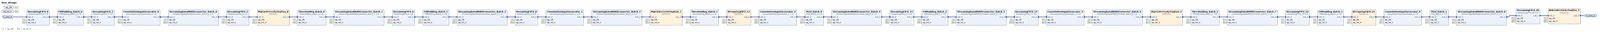
[diagram p0: block diagram of the top level, whole]
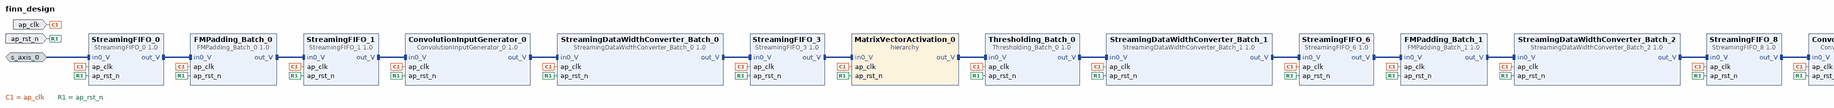
[diagram p1: block diagram of the top level, left part]
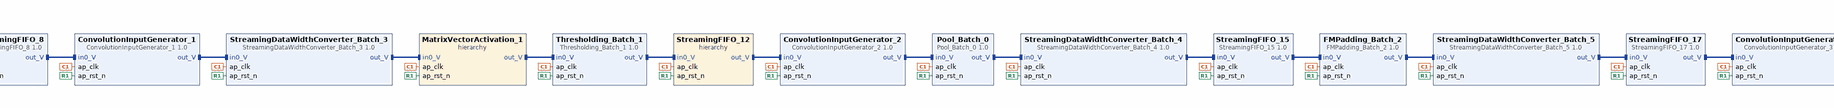
[diagram p2: block diagram of the top level, centre part]
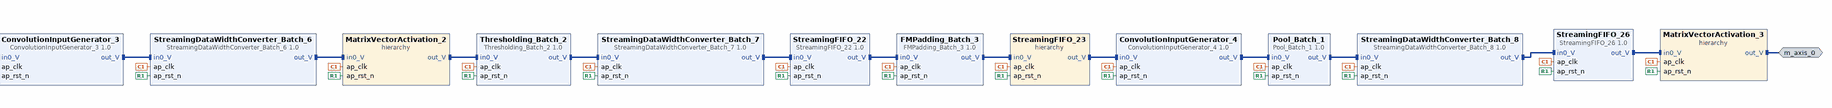
[diagram p3: block diagram of the top level, right part]
# Vivado block design finn_design, xc7z020clg400-1, Vivado 2022.1
create_bd_design finn_design

create_bd_intf_port -mode Slave -vlnv xilinx.com:interface:axis_rtl:1.0 s_axis_0
set_property -dict [list \
  CONFIG.FREQ_HZ 100000000.000000 \
  CONFIG.HAS_TKEEP 0 \
  CONFIG.HAS_TLAST 0 \
  CONFIG.HAS_TREADY 1 \
  CONFIG.HAS_TSTRB 0 \
  CONFIG.LAYERED_METADATA undef \
  CONFIG.TDATA_NUM_BYTES 1 \
  CONFIG.TDEST_WIDTH 0 \
  CONFIG.TID_WIDTH 0 \
  CONFIG.TUSER_WIDTH 0 \
] [get_bd_intf_ports s_axis_0]
create_bd_intf_port -mode Master -vlnv xilinx.com:interface:axis_rtl:1.0 m_axis_0
set_property -dict {CONFIG.FREQ_HZ 100000000.000000} [get_bd_intf_ports m_axis_0]
create_bd_port -dir I -type clk ap_clk
set_property -dict {CONFIG.FREQ_HZ 100000000.000000} [get_bd_ports ap_clk]
create_bd_port -dir I -type rst ap_rst_n

create_bd_cell -type ip -vlnv xilinx.com:hls:StreamingFIFO_0:1.0 StreamingFIFO_0
create_bd_cell -type ip -vlnv xilinx.com:hls:FMPadding_Batch_0:1.0 FMPadding_Batch_0
create_bd_cell -type ip -vlnv xilinx.com:hls:StreamingFIFO_1:1.0 StreamingFIFO_1
create_bd_cell -type ip -vlnv xilinx.com:hls:ConvolutionInputGenerator_0:1.0 ConvolutionInputGenerator_0
create_bd_cell -type ip -vlnv xilinx.com:hls:StreamingDataWidthConverter_Batch_0:1.0 StreamingDataWidthConverter_Batch_0
create_bd_cell -type ip -vlnv xilinx.com:hls:StreamingFIFO_3:1.0 StreamingFIFO_3
create_bd_cell -type hier MatrixVectorActivation_0
create_bd_cell -type ip -vlnv xilinx.com:hls:Thresholding_Batch_0:1.0 Thresholding_Batch_0
create_bd_cell -type ip -vlnv xilinx.com:hls:StreamingDataWidthConverter_Batch_1:1.0 StreamingDataWidthConverter_Batch_1
create_bd_cell -type ip -vlnv xilinx.com:hls:StreamingFIFO_6:1.0 StreamingFIFO_6
create_bd_cell -type ip -vlnv xilinx.com:hls:FMPadding_Batch_1:1.0 FMPadding_Batch_1
create_bd_cell -type ip -vlnv xilinx.com:hls:StreamingDataWidthConverter_Batch_2:1.0 StreamingDataWidthConverter_Batch_2
create_bd_cell -type ip -vlnv xilinx.com:hls:StreamingFIFO_8:1.0 StreamingFIFO_8
create_bd_cell -type ip -vlnv xilinx.com:hls:ConvolutionInputGenerator_1:1.0 ConvolutionInputGenerator_1
create_bd_cell -type ip -vlnv xilinx.com:hls:StreamingDataWidthConverter_Batch_3:1.0 StreamingDataWidthConverter_Batch_3
create_bd_cell -type hier MatrixVectorActivation_1
create_bd_cell -type ip -vlnv xilinx.com:hls:Thresholding_Batch_1:1.0 Thresholding_Batch_1
create_bd_cell -type hier StreamingFIFO_12
create_bd_cell -type ip -vlnv xilinx.com:hls:ConvolutionInputGenerator_2:1.0 ConvolutionInputGenerator_2
create_bd_cell -type ip -vlnv xilinx.com:hls:Pool_Batch_0:1.0 Pool_Batch_0
create_bd_cell -type ip -vlnv xilinx.com:hls:StreamingDataWidthConverter_Batch_4:1.0 StreamingDataWidthConverter_Batch_4
create_bd_cell -type ip -vlnv xilinx.com:hls:StreamingFIFO_15:1.0 StreamingFIFO_15
create_bd_cell -type ip -vlnv xilinx.com:hls:FMPadding_Batch_2:1.0 FMPadding_Batch_2
create_bd_cell -type ip -vlnv xilinx.com:hls:StreamingDataWidthConverter_Batch_5:1.0 StreamingDataWidthConverter_Batch_5
create_bd_cell -type ip -vlnv xilinx.com:hls:StreamingFIFO_17:1.0 StreamingFIFO_17
create_bd_cell -type ip -vlnv xilinx.com:hls:ConvolutionInputGenerator_3:1.0 ConvolutionInputGenerator_3
create_bd_cell -type ip -vlnv xilinx.com:hls:StreamingDataWidthConverter_Batch_6:1.0 StreamingDataWidthConverter_Batch_6
create_bd_cell -type hier MatrixVectorActivation_2
create_bd_cell -type ip -vlnv xilinx.com:hls:Thresholding_Batch_2:1.0 Thresholding_Batch_2
create_bd_cell -type ip -vlnv xilinx.com:hls:StreamingDataWidthConverter_Batch_7:1.0 StreamingDataWidthConverter_Batch_7
create_bd_cell -type ip -vlnv xilinx.com:hls:StreamingFIFO_22:1.0 StreamingFIFO_22
create_bd_cell -type ip -vlnv xilinx.com:hls:FMPadding_Batch_3:1.0 FMPadding_Batch_3
create_bd_cell -type hier StreamingFIFO_23
create_bd_cell -type ip -vlnv xilinx.com:hls:ConvolutionInputGenerator_4:1.0 ConvolutionInputGenerator_4
create_bd_cell -type ip -vlnv xilinx.com:hls:Pool_Batch_1:1.0 Pool_Batch_1
create_bd_cell -type ip -vlnv xilinx.com:hls:StreamingDataWidthConverter_Batch_8:1.0 StreamingDataWidthConverter_Batch_8
create_bd_cell -type ip -vlnv xilinx.com:hls:StreamingFIFO_26:1.0 StreamingFIFO_26
create_bd_cell -type hier MatrixVectorActivation_3

# ---- hierarchy /MatrixVectorActivation_0 ----
current_bd_instance /MatrixVectorActivation_0
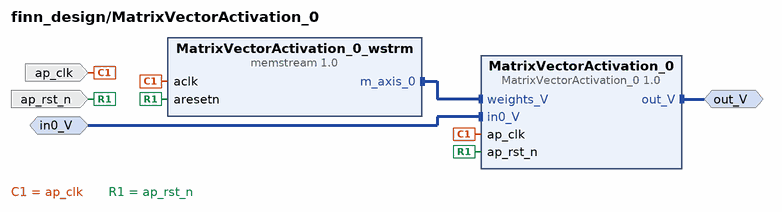
[diagram p4: block diagram inside /MatrixVectorActivation_0]
create_bd_intf_pin -mode Master -vlnv xilinx.com:interface:axis_rtl:1.0 out_V
create_bd_intf_pin -mode Slave -vlnv xilinx.com:interface:axis_rtl:1.0 in0_V
create_bd_pin -dir I -type clk ap_clk
create_bd_pin -dir I -type rst ap_rst_n

create_bd_cell -type ip -vlnv xilinx.com:hls:MatrixVectorActivation_0:1.0 MatrixVectorActivation_0
create_bd_cell -type ip -vlnv xilinx.com:user:memstream:1.0 MatrixVectorActivation_0_wstrm
set_property -dict [list \
  CONFIG.MEM_DEPTH 16 \
  CONFIG.MEM_INIT /scratch/bkwan/FINN/finn/ML_LL/Model/CNN-1D/tmp/code_gen_ipgen_MatrixVectorActivation_0_wx4gew9p/ \
  CONFIG.MEM_WIDTH 72 \
  CONFIG.NSTREAMS 1 \
  CONFIG.RAM_STYLE auto \
  CONFIG.STRM0_DEPTH 16 \
  CONFIG.STRM0_OFFSET 0 \
  CONFIG.STRM0_WIDTH 72 \
] [get_bd_cells MatrixVectorActivation_0_wstrm]

# ---- hierarchy /MatrixVectorActivation_1 ----
current_bd_instance /MatrixVectorActivation_1
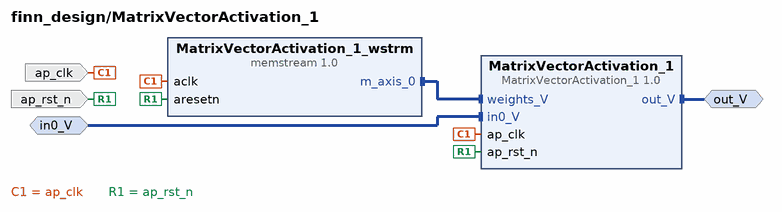
[diagram p5: block diagram inside /MatrixVectorActivation_1]
create_bd_intf_pin -mode Master -vlnv xilinx.com:interface:axis_rtl:1.0 out_V
create_bd_intf_pin -mode Slave -vlnv xilinx.com:interface:axis_rtl:1.0 in0_V
create_bd_pin -dir I -type clk ap_clk
create_bd_pin -dir I -type rst ap_rst_n

create_bd_cell -type ip -vlnv xilinx.com:hls:MatrixVectorActivation_1:1.0 MatrixVectorActivation_1
create_bd_cell -type ip -vlnv xilinx.com:user:memstream:1.0 MatrixVectorActivation_1_wstrm
set_property -dict [list \
  CONFIG.MEM_DEPTH 16 \
  CONFIG.MEM_INIT /scratch/bkwan/FINN/finn/ML_LL/Model/CNN-1D/tmp/code_gen_ipgen_MatrixVectorActivation_1__w__vqmd/ \
  CONFIG.MEM_WIDTH 2304 \
  CONFIG.NSTREAMS 1 \
  CONFIG.RAM_STYLE auto \
  CONFIG.STRM0_DEPTH 16 \
  CONFIG.STRM0_OFFSET 0 \
  CONFIG.STRM0_WIDTH 2304 \
] [get_bd_cells MatrixVectorActivation_1_wstrm]

# ---- hierarchy /StreamingFIFO_12 ----
current_bd_instance /StreamingFIFO_12
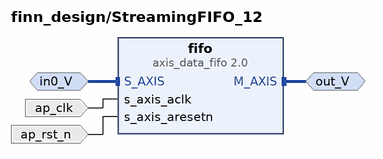
[diagram p6: block diagram inside /StreamingFIFO_12]
create_bd_intf_pin -mode Master -vlnv xilinx.com:interface:axis_rtl:1.0 out_V
create_bd_intf_pin -mode Slave -vlnv xilinx.com:interface:axis_rtl:1.0 in0_V
create_bd_pin -dir I -type clk ap_clk
create_bd_pin -dir I -type rst ap_rst_n

create_bd_cell -type ip -vlnv xilinx.com:ip:axis_data_fifo:2.0 fifo
set_property -dict {CONFIG.FIFO_DEPTH 512 CONFIG.FIFO_MEMORY_TYPE auto CONFIG.TDATA_NUM_BYTES 2} [get_bd_cells fifo]

# ---- hierarchy /MatrixVectorActivation_2 ----
current_bd_instance /MatrixVectorActivation_2
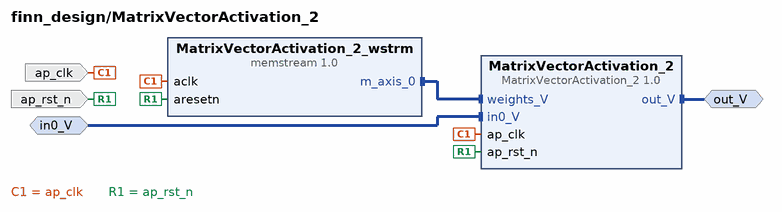
[diagram p7: block diagram inside /MatrixVectorActivation_2]
create_bd_intf_pin -mode Master -vlnv xilinx.com:interface:axis_rtl:1.0 out_V
create_bd_intf_pin -mode Slave -vlnv xilinx.com:interface:axis_rtl:1.0 in0_V
create_bd_pin -dir I -type clk ap_clk
create_bd_pin -dir I -type rst ap_rst_n

create_bd_cell -type ip -vlnv xilinx.com:hls:MatrixVectorActivation_2:1.0 MatrixVectorActivation_2
create_bd_cell -type ip -vlnv xilinx.com:user:memstream:1.0 MatrixVectorActivation_2_wstrm
set_property -dict [list \
  CONFIG.MEM_DEPTH 64 \
  CONFIG.MEM_INIT /scratch/bkwan/FINN/finn/ML_LL/Model/CNN-1D/tmp/code_gen_ipgen_MatrixVectorActivation_2_g310_uuv/ \
  CONFIG.MEM_WIDTH 2304 \
  CONFIG.NSTREAMS 1 \
  CONFIG.RAM_STYLE auto \
  CONFIG.STRM0_DEPTH 64 \
  CONFIG.STRM0_OFFSET 0 \
  CONFIG.STRM0_WIDTH 2304 \
] [get_bd_cells MatrixVectorActivation_2_wstrm]

# ---- hierarchy /StreamingFIFO_23 ----
current_bd_instance /StreamingFIFO_23
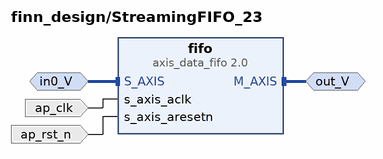
[diagram p8: block diagram inside /StreamingFIFO_23]
create_bd_intf_pin -mode Master -vlnv xilinx.com:interface:axis_rtl:1.0 out_V
create_bd_intf_pin -mode Slave -vlnv xilinx.com:interface:axis_rtl:1.0 in0_V
create_bd_pin -dir I -type clk ap_clk
create_bd_pin -dir I -type rst ap_rst_n

create_bd_cell -type ip -vlnv xilinx.com:ip:axis_data_fifo:2.0 fifo
set_property -dict {CONFIG.FIFO_DEPTH 1024 CONFIG.FIFO_MEMORY_TYPE auto CONFIG.TDATA_NUM_BYTES 2} [get_bd_cells fifo]

# ---- hierarchy /MatrixVectorActivation_3 ----
current_bd_instance /MatrixVectorActivation_3
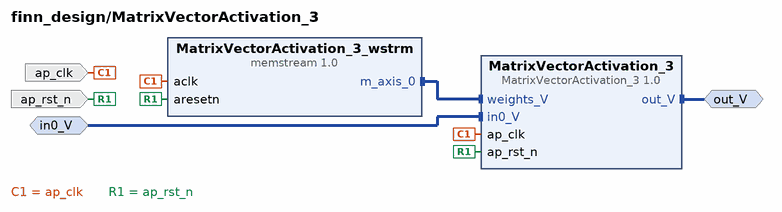
[diagram p9: block diagram inside /MatrixVectorActivation_3]
create_bd_intf_pin -mode Master -vlnv xilinx.com:interface:axis_rtl:1.0 out_V
create_bd_intf_pin -mode Slave -vlnv xilinx.com:interface:axis_rtl:1.0 in0_V
create_bd_pin -dir I -type clk ap_clk
create_bd_pin -dir I -type rst ap_rst_n

create_bd_cell -type ip -vlnv xilinx.com:hls:MatrixVectorActivation_3:1.0 MatrixVectorActivation_3
create_bd_cell -type ip -vlnv xilinx.com:user:memstream:1.0 MatrixVectorActivation_3_wstrm
set_property -dict [list \
  CONFIG.MEM_DEPTH 960 \
  CONFIG.MEM_INIT /scratch/bkwan/FINN/finn/ML_LL/Model/CNN-1D/tmp/code_gen_ipgen_MatrixVectorActivation_3_w6za0nuu/ \
  CONFIG.MEM_WIDTH 32 \
  CONFIG.NSTREAMS 1 \
  CONFIG.RAM_STYLE auto \
  CONFIG.STRM0_DEPTH 960 \
  CONFIG.STRM0_OFFSET 0 \
  CONFIG.STRM0_WIDTH 32 \
] [get_bd_cells MatrixVectorActivation_3_wstrm]

# ---- connections ----

current_bd_instance /MatrixVectorActivation_0
connect_bd_intf_net [get_bd_intf_pins out_V] [get_bd_intf_pins MatrixVectorActivation_0/out_V]
connect_bd_intf_net [get_bd_intf_pins MatrixVectorActivation_0_wstrm/m_axis_0] [get_bd_intf_pins MatrixVectorActivation_0/weights_V]
connect_bd_intf_net [get_bd_intf_pins in0_V] [get_bd_intf_pins MatrixVectorActivation_0/in0_V]
connect_bd_net [get_bd_pins ap_clk] [get_bd_pins MatrixVectorActivation_0_wstrm/aclk] [get_bd_pins MatrixVectorActivation_0/ap_clk]
connect_bd_net [get_bd_pins ap_rst_n] [get_bd_pins MatrixVectorActivation_0_wstrm/aresetn] [get_bd_pins MatrixVectorActivation_0/ap_rst_n]

current_bd_instance /MatrixVectorActivation_1
connect_bd_intf_net [get_bd_intf_pins out_V] [get_bd_intf_pins MatrixVectorActivation_1/out_V]
connect_bd_intf_net [get_bd_intf_pins MatrixVectorActivation_1_wstrm/m_axis_0] [get_bd_intf_pins MatrixVectorActivation_1/weights_V]
connect_bd_intf_net [get_bd_intf_pins in0_V] [get_bd_intf_pins MatrixVectorActivation_1/in0_V]
connect_bd_net [get_bd_pins ap_clk] [get_bd_pins MatrixVectorActivation_1_wstrm/aclk] [get_bd_pins MatrixVectorActivation_1/ap_clk]
connect_bd_net [get_bd_pins ap_rst_n] [get_bd_pins MatrixVectorActivation_1_wstrm/aresetn] [get_bd_pins MatrixVectorActivation_1/ap_rst_n]

current_bd_instance /StreamingFIFO_12
connect_bd_intf_net [get_bd_intf_pins out_V] [get_bd_intf_pins fifo/M_AXIS]
connect_bd_intf_net [get_bd_intf_pins in0_V] [get_bd_intf_pins fifo/S_AXIS]
connect_bd_net [get_bd_pins ap_clk] [get_bd_pins fifo/s_axis_aclk]
connect_bd_net [get_bd_pins ap_rst_n] [get_bd_pins fifo/s_axis_aresetn]

current_bd_instance /MatrixVectorActivation_2
connect_bd_intf_net [get_bd_intf_pins out_V] [get_bd_intf_pins MatrixVectorActivation_2/out_V]
connect_bd_intf_net [get_bd_intf_pins MatrixVectorActivation_2_wstrm/m_axis_0] [get_bd_intf_pins MatrixVectorActivation_2/weights_V]
connect_bd_intf_net [get_bd_intf_pins in0_V] [get_bd_intf_pins MatrixVectorActivation_2/in0_V]
connect_bd_net [get_bd_pins ap_clk] [get_bd_pins MatrixVectorActivation_2_wstrm/aclk] [get_bd_pins MatrixVectorActivation_2/ap_clk]
connect_bd_net [get_bd_pins ap_rst_n] [get_bd_pins MatrixVectorActivation_2_wstrm/aresetn] [get_bd_pins MatrixVectorActivation_2/ap_rst_n]

current_bd_instance /StreamingFIFO_23
connect_bd_intf_net [get_bd_intf_pins out_V] [get_bd_intf_pins fifo/M_AXIS]
connect_bd_intf_net [get_bd_intf_pins in0_V] [get_bd_intf_pins fifo/S_AXIS]
connect_bd_net [get_bd_pins ap_clk] [get_bd_pins fifo/s_axis_aclk]
connect_bd_net [get_bd_pins ap_rst_n] [get_bd_pins fifo/s_axis_aresetn]

current_bd_instance /MatrixVectorActivation_3
connect_bd_intf_net [get_bd_intf_pins out_V] [get_bd_intf_pins MatrixVectorActivation_3/out_V]
connect_bd_intf_net [get_bd_intf_pins MatrixVectorActivation_3_wstrm/m_axis_0] [get_bd_intf_pins MatrixVectorActivation_3/weights_V]
connect_bd_intf_net [get_bd_intf_pins in0_V] [get_bd_intf_pins MatrixVectorActivation_3/in0_V]
connect_bd_net [get_bd_pins ap_clk] [get_bd_pins MatrixVectorActivation_3_wstrm/aclk] [get_bd_pins MatrixVectorActivation_3/ap_clk]
connect_bd_net [get_bd_pins ap_rst_n] [get_bd_pins MatrixVectorActivation_3_wstrm/aresetn] [get_bd_pins MatrixVectorActivation_3/ap_rst_n]

current_bd_instance /
connect_bd_intf_net [get_bd_intf_pins ConvolutionInputGenerator_0/out_V] [get_bd_intf_pins StreamingDataWidthConverter_Batch_0/in0_V]
connect_bd_intf_net [get_bd_intf_pins ConvolutionInputGenerator_1/out_V] [get_bd_intf_pins StreamingDataWidthConverter_Batch_3/in0_V]
connect_bd_intf_net [get_bd_intf_pins ConvolutionInputGenerator_2/out_V] [get_bd_intf_pins Pool_Batch_0/in0_V]
connect_bd_intf_net [get_bd_intf_pins ConvolutionInputGenerator_3/out_V] [get_bd_intf_pins StreamingDataWidthConverter_Batch_6/in0_V]
connect_bd_intf_net [get_bd_intf_pins ConvolutionInputGenerator_4/out_V] [get_bd_intf_pins Pool_Batch_1/in0_V]
connect_bd_intf_net [get_bd_intf_pins FMPadding_Batch_0/out_V] [get_bd_intf_pins StreamingFIFO_1/in0_V]
connect_bd_intf_net [get_bd_intf_pins FMPadding_Batch_1/out_V] [get_bd_intf_pins StreamingDataWidthConverter_Batch_2/in0_V]
connect_bd_intf_net [get_bd_intf_pins FMPadding_Batch_2/out_V] [get_bd_intf_pins StreamingDataWidthConverter_Batch_5/in0_V]
connect_bd_intf_net [get_bd_intf_pins FMPadding_Batch_3/out_V] [get_bd_intf_pins StreamingFIFO_23/in0_V]
connect_bd_intf_net [get_bd_intf_pins MatrixVectorActivation_0/out_V] [get_bd_intf_pins Thresholding_Batch_0/in0_V]
connect_bd_intf_net [get_bd_intf_pins MatrixVectorActivation_1/out_V] [get_bd_intf_pins Thresholding_Batch_1/in0_V]
connect_bd_intf_net [get_bd_intf_pins MatrixVectorActivation_2/out_V] [get_bd_intf_pins Thresholding_Batch_2/in0_V]
connect_bd_intf_net [get_bd_intf_ports m_axis_0] [get_bd_intf_pins MatrixVectorActivation_3/out_V]
connect_bd_intf_net [get_bd_intf_pins Pool_Batch_0/out_V] [get_bd_intf_pins StreamingDataWidthConverter_Batch_4/in0_V]
connect_bd_intf_net [get_bd_intf_pins Pool_Batch_1/out_V] [get_bd_intf_pins StreamingDataWidthConverter_Batch_8/in0_V]
connect_bd_intf_net [get_bd_intf_pins StreamingDataWidthConverter_Batch_0/out_V] [get_bd_intf_pins StreamingFIFO_3/in0_V]
connect_bd_intf_net [get_bd_intf_pins StreamingDataWidthConverter_Batch_1/out_V] [get_bd_intf_pins StreamingFIFO_6/in0_V]
connect_bd_intf_net [get_bd_intf_pins StreamingDataWidthConverter_Batch_2/out_V] [get_bd_intf_pins StreamingFIFO_8/in0_V]
connect_bd_intf_net [get_bd_intf_pins StreamingDataWidthConverter_Batch_3/out_V] [get_bd_intf_pins MatrixVectorActivation_1/in0_V]
connect_bd_intf_net [get_bd_intf_pins StreamingDataWidthConverter_Batch_4/out_V] [get_bd_intf_pins StreamingFIFO_15/in0_V]
connect_bd_intf_net [get_bd_intf_pins StreamingDataWidthConverter_Batch_5/out_V] [get_bd_intf_pins StreamingFIFO_17/in0_V]
connect_bd_intf_net [get_bd_intf_pins StreamingDataWidthConverter_Batch_6/out_V] [get_bd_intf_pins MatrixVectorActivation_2/in0_V]
connect_bd_intf_net [get_bd_intf_pins StreamingDataWidthConverter_Batch_7/out_V] [get_bd_intf_pins StreamingFIFO_22/in0_V]
connect_bd_intf_net [get_bd_intf_pins StreamingDataWidthConverter_Batch_8/out_V] [get_bd_intf_pins StreamingFIFO_26/in0_V]
connect_bd_intf_net [get_bd_intf_pins StreamingFIFO_0/out_V] [get_bd_intf_pins FMPadding_Batch_0/in0_V]
connect_bd_intf_net [get_bd_intf_pins StreamingFIFO_12/out_V] [get_bd_intf_pins ConvolutionInputGenerator_2/in0_V]
connect_bd_intf_net [get_bd_intf_pins StreamingFIFO_15/out_V] [get_bd_intf_pins FMPadding_Batch_2/in0_V]
connect_bd_intf_net [get_bd_intf_pins StreamingFIFO_17/out_V] [get_bd_intf_pins ConvolutionInputGenerator_3/in0_V]
connect_bd_intf_net [get_bd_intf_pins StreamingFIFO_1/out_V] [get_bd_intf_pins ConvolutionInputGenerator_0/in0_V]
connect_bd_intf_net [get_bd_intf_pins StreamingFIFO_22/out_V] [get_bd_intf_pins FMPadding_Batch_3/in0_V]
connect_bd_intf_net [get_bd_intf_pins StreamingFIFO_23/out_V] [get_bd_intf_pins ConvolutionInputGenerator_4/in0_V]
connect_bd_intf_net [get_bd_intf_pins StreamingFIFO_26/out_V] [get_bd_intf_pins MatrixVectorActivation_3/in0_V]
connect_bd_intf_net [get_bd_intf_pins StreamingFIFO_3/out_V] [get_bd_intf_pins MatrixVectorActivation_0/in0_V]
connect_bd_intf_net [get_bd_intf_pins StreamingFIFO_6/out_V] [get_bd_intf_pins FMPadding_Batch_1/in0_V]
connect_bd_intf_net [get_bd_intf_pins StreamingFIFO_8/out_V] [get_bd_intf_pins ConvolutionInputGenerator_1/in0_V]
connect_bd_intf_net [get_bd_intf_pins Thresholding_Batch_0/out_V] [get_bd_intf_pins StreamingDataWidthConverter_Batch_1/in0_V]
connect_bd_intf_net [get_bd_intf_pins Thresholding_Batch_1/out_V] [get_bd_intf_pins StreamingFIFO_12/in0_V]
connect_bd_intf_net [get_bd_intf_pins Thresholding_Batch_2/out_V] [get_bd_intf_pins StreamingDataWidthConverter_Batch_7/in0_V]
connect_bd_intf_net -intf_net in0_V_0_1 [get_bd_intf_ports s_axis_0] [get_bd_intf_pins StreamingFIFO_0/in0_V]
connect_bd_net -net ap_clk_0_1 [get_bd_ports ap_clk] \
  [get_bd_pins StreamingFIFO_0/ap_clk] [get_bd_pins FMPadding_Batch_0/ap_clk] [get_bd_pins StreamingFIFO_1/ap_clk] \
  [get_bd_pins ConvolutionInputGenerator_0/ap_clk] [get_bd_pins StreamingDataWidthConverter_Batch_0/ap_clk] \
  [get_bd_pins StreamingFIFO_3/ap_clk] [get_bd_pins MatrixVectorActivation_0/ap_clk] \
  [get_bd_pins Thresholding_Batch_0/ap_clk] [get_bd_pins StreamingDataWidthConverter_Batch_1/ap_clk] \
  [get_bd_pins StreamingFIFO_6/ap_clk] [get_bd_pins FMPadding_Batch_1/ap_clk] \
  [get_bd_pins StreamingDataWidthConverter_Batch_2/ap_clk] [get_bd_pins StreamingFIFO_8/ap_clk] \
  [get_bd_pins ConvolutionInputGenerator_1/ap_clk] [get_bd_pins StreamingDataWidthConverter_Batch_3/ap_clk] \
  [get_bd_pins MatrixVectorActivation_1/ap_clk] [get_bd_pins Thresholding_Batch_1/ap_clk] \
  [get_bd_pins StreamingFIFO_12/ap_clk] [get_bd_pins ConvolutionInputGenerator_2/ap_clk] [get_bd_pins Pool_Batch_0/ap_clk] \
  [get_bd_pins StreamingDataWidthConverter_Batch_4/ap_clk] [get_bd_pins StreamingFIFO_15/ap_clk] \
  [get_bd_pins FMPadding_Batch_2/ap_clk] [get_bd_pins StreamingDataWidthConverter_Batch_5/ap_clk] \
  [get_bd_pins StreamingFIFO_17/ap_clk] [get_bd_pins ConvolutionInputGenerator_3/ap_clk] \
  [get_bd_pins StreamingDataWidthConverter_Batch_6/ap_clk] [get_bd_pins MatrixVectorActivation_2/ap_clk] \
  [get_bd_pins Thresholding_Batch_2/ap_clk] [get_bd_pins StreamingDataWidthConverter_Batch_7/ap_clk] \
  [get_bd_pins StreamingFIFO_22/ap_clk] [get_bd_pins FMPadding_Batch_3/ap_clk] [get_bd_pins StreamingFIFO_23/ap_clk] \
  [get_bd_pins ConvolutionInputGenerator_4/ap_clk] [get_bd_pins Pool_Batch_1/ap_clk] \
  [get_bd_pins StreamingDataWidthConverter_Batch_8/ap_clk] [get_bd_pins StreamingFIFO_26/ap_clk] \
  [get_bd_pins MatrixVectorActivation_3/ap_clk]
connect_bd_net -net ap_rst_n_0_1 [get_bd_ports ap_rst_n] \
  [get_bd_pins StreamingFIFO_0/ap_rst_n] [get_bd_pins FMPadding_Batch_0/ap_rst_n] [get_bd_pins StreamingFIFO_1/ap_rst_n] \
  [get_bd_pins ConvolutionInputGenerator_0/ap_rst_n] [get_bd_pins StreamingDataWidthConverter_Batch_0/ap_rst_n] \
  [get_bd_pins StreamingFIFO_3/ap_rst_n] [get_bd_pins MatrixVectorActivation_0/ap_rst_n] \
  [get_bd_pins Thresholding_Batch_0/ap_rst_n] [get_bd_pins StreamingDataWidthConverter_Batch_1/ap_rst_n] \
  [get_bd_pins StreamingFIFO_6/ap_rst_n] [get_bd_pins FMPadding_Batch_1/ap_rst_n] \
  [get_bd_pins StreamingDataWidthConverter_Batch_2/ap_rst_n] [get_bd_pins StreamingFIFO_8/ap_rst_n] \
  [get_bd_pins ConvolutionInputGenerator_1/ap_rst_n] [get_bd_pins StreamingDataWidthConverter_Batch_3/ap_rst_n] \
  [get_bd_pins MatrixVectorActivation_1/ap_rst_n] [get_bd_pins Thresholding_Batch_1/ap_rst_n] \
  [get_bd_pins StreamingFIFO_12/ap_rst_n] [get_bd_pins ConvolutionInputGenerator_2/ap_rst_n] \
  [get_bd_pins Pool_Batch_0/ap_rst_n] [get_bd_pins StreamingDataWidthConverter_Batch_4/ap_rst_n] \
  [get_bd_pins StreamingFIFO_15/ap_rst_n] [get_bd_pins FMPadding_Batch_2/ap_rst_n] \
  [get_bd_pins StreamingDataWidthConverter_Batch_5/ap_rst_n] [get_bd_pins StreamingFIFO_17/ap_rst_n] \
  [get_bd_pins ConvolutionInputGenerator_3/ap_rst_n] [get_bd_pins StreamingDataWidthConverter_Batch_6/ap_rst_n] \
  [get_bd_pins MatrixVectorActivation_2/ap_rst_n] [get_bd_pins Thresholding_Batch_2/ap_rst_n] \
  [get_bd_pins StreamingDataWidthConverter_Batch_7/ap_rst_n] [get_bd_pins StreamingFIFO_22/ap_rst_n] \
  [get_bd_pins FMPadding_Batch_3/ap_rst_n] [get_bd_pins StreamingFIFO_23/ap_rst_n] \
  [get_bd_pins ConvolutionInputGenerator_4/ap_rst_n] [get_bd_pins Pool_Batch_1/ap_rst_n] \
  [get_bd_pins StreamingDataWidthConverter_Batch_8/ap_rst_n] [get_bd_pins StreamingFIFO_26/ap_rst_n] \
  [get_bd_pins MatrixVectorActivation_3/ap_rst_n]

validate_bd_design
save_bd_design
